# EAGLE schematic NMOS_DESIGN (EAGLE 8.0.2)
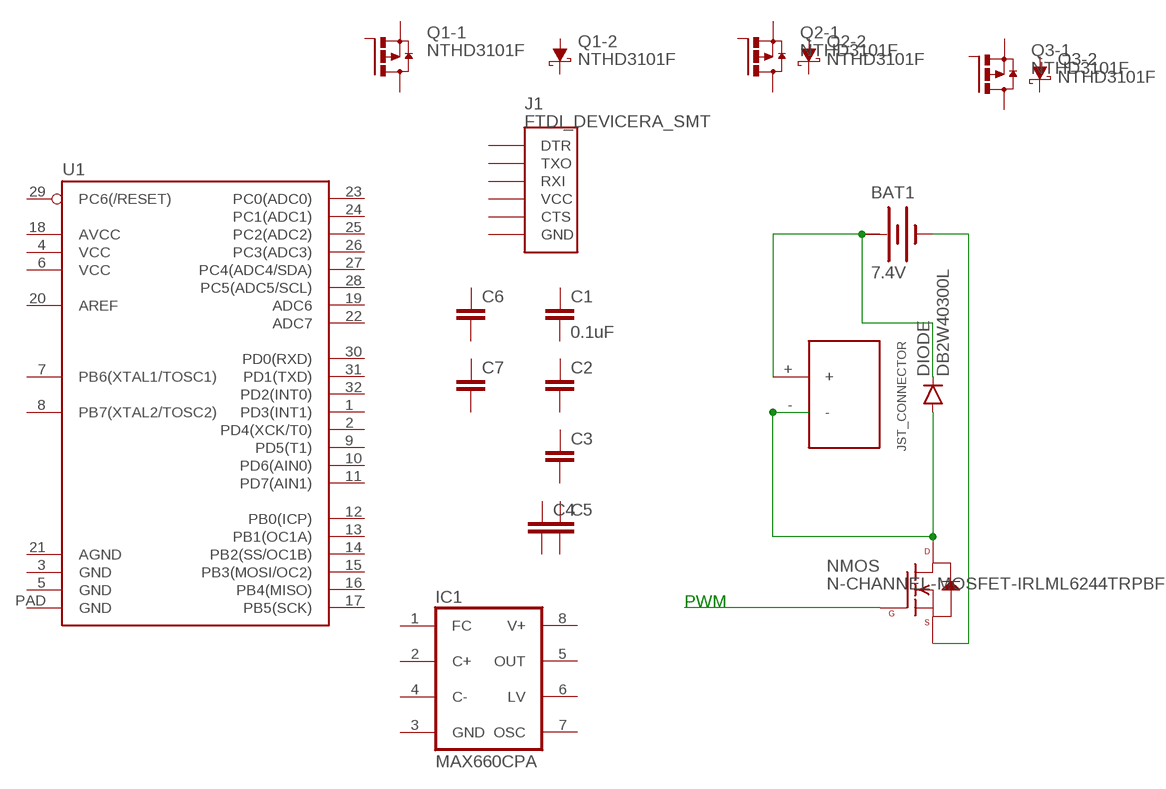
[diagram p0: schematic, sheet 1]

## Parts
BAT1  7.4V  BATTERY  [BATTERY]
C1  0.1uF  0.1UF-25V(+80/-20%)(0603)  [0603-CAP]
C2  CAP0603-CAP  [0603-CAP]
C3  CAP0603-CAP  [0603-CAP]
C4  CAP0603-CAP  [0603-CAP]
C5  CAP0603-CAP  [0603-CAP]
C6  CAP0603-CAP  [0603-CAP]
C7  CAP0603-CAP  [0603-CAP]
DIODE  DB2W40300L  [MINI2-F3-B]
IC1  MAX660CPA  [DIL08]
J1  FTDI_DEVICERA_SMT  [FTDI_DEVICE_RA_SMT]
MOTOR  JST_CONNECTOR_FEMALE  [JST_CONNECTOR_FEMALE]
NMOS  N-CHANNEL-MOSFET-IRLML6244TRPBF  [SOT23-3]
Q1  NTHD3101F  [CHIPFET-1206A]
Q2  NTHD3101F  [CHIPFET-1206A]
Q3  NTHD3101F  [CHIPFET-1206A]
U1  ATMEGA328P_MLFMLF32  [MLF32-PAD]

## Nets
N$1: BAT1.+ DIODE.NEG(GPIN) MOTOR.+
N$2: DIODE.POS(PPIN) MOTOR.- NMOS.3(D)
N$3: BAT1.- NMOS.2(S)
N$5: NMOS.1(G)
Unconnected: C1.1 C1.2 C2.1 C2.2 C3.1 C3.2 C4.1 C4.2 C5.1 C5.2 C6.1 C6.2 C7.1 C7.2 IC1.1(FC) IC1.2(C+) IC1.4(C-) IC1.5(OUT) IC1.6(LV) IC1.7(OSC) J1.1(DTR) J1.2(TXO) J1.3(RXI) J1.4(VCC) J1.5(CTS) J1.6(GND) Q1.1(-2:A) Q1.2(-2:A) Q1.3(-1:S) Q1.4(-1:G) Q1.5(-1:D) Q1.6(-1:D) Q1.7(-2:C) Q1.8(-2:C) Q2.1(-2:A) Q2.2(-2:A) Q2.3(-1:S) Q2.4(-1:G) Q2.5(-1:D) Q2.6(-1:D) Q2.7(-2:C) Q2.8(-2:C) Q3.1(-2:A) Q3.2(-2:A) Q3.3(-1:S) Q3.4(-1:G) Q3.5(-1:D) Q3.6(-1:D) Q3.7(-2:C) Q3.8(-2:C) U1.1(PD3(INT1)) U1.2(PD4(XCK/T0)) U1.3(GND) U1.4(VCC) U1.5(GND) U1.6(VCC) U1.7(PB6(XTAL1/TOSC1)) U1.8(PB7(XTAL2/TOSC2)) U1.9(PD5(T1)) U1.10(PD6(AIN0)) U1.11(PD7(AIN1)) U1.12(PB0(ICP)) U1.13(PB1(OC1A)) U1.14(PB2(SS/OC1B)) U1.15(PB3(MOSI/OC2)) U1.16(PB4(MISO)) U1.17(PB5(SCK)) U1.18(AVCC) U1.19(ADC6) U1.20(AREF) U1.21(AGND) U1.22(ADC7) U1.23(PC0(ADC0)) U1.24(PC1(ADC1)) U1.25(PC2(ADC2)) U1.26(PC3(ADC3)) U1.27(PC4(ADC4/SDA)) U1.28(PC5(ADC5/SCL)) U1.29(PC6(/RESET)) U1.30(PD0(RXD)) U1.31(PD1(TXD)) U1.32(PD2(INT0)) U1.PAD(GND)

## Notes on the sheet
- PWM

## Power pins joined to a net without a drawn wire
+: BAT1.+@1(+)
GND: IC1.3(GND)
V+: IC1.8(V+)

## Library data of the parts
BAT1 = special:BATTERY: BATTERY
C1 = SparkFun-Capacitors:0.1UF-25V(+80/-20%)(0603): CAP-00810 Ceramic Standard decoupling cap; PROD_ID: CAP-00810
C2-C7 = SparkFun-Passives:CAP: Capacitor Standard 0603 ceramic capacitor, and 0.1" leaded capacitor.
DIODE = quad:DB2W40300L
IC1 = maxim:MAX660CPA: Charge-pump VOLTAGE CONVERTER; MF: MAXIM; MPN: MAX660CPA; OC_FARNELL: 1187928; OC_NEWARK: 34C3964
J1 = quad:FTDI_DEVICE: Connector which mates to FTDI basic or FTDI cable.; PROD_ID: CONN-08971
MOTOR = quad:JST_CONNECTOR_FEMALE
NMOS = quad:N-CHANNEL-MOSFET: N-Channel MOSFET Mode Field Effect Transistor; DATASHEET: http://www.mouser.com/ds/2/196/irlml6244pbf-936666.pdf; MOUSER: 942-IRLML6244TRPBF; URL: http://www.mouser.com/Search/ProductDetail.aspx?R=IRLML6244TRPBFvirtualkey57370000virtualkey942-IRLML6244TRPBF
Q1-Q3 = transistor-power:NTHD3101F: Power MOSFET and Schottky Diode -20 V, FETKY (TM), P-Channel, 4.4 A, with 4.1 A Schottky Barrier Diode, ChipFET (TM) Source: http://www.onsemi.com/pub/Collateral/NTHD3101F-D.PDF
U1 = SparkFun-DigitalIC:ATMEGA328P_MLF: 32-Pin Atmega328 part Commonly used on Arduino compatible boards Available in QFP and QFN packages TQFP is IC-09069 QFN is non-stock